# Altium schematic sheet TopLevelSchem.SchDoc
size Letter; DrawnBy: Adam Gilbert; Organization: Altium Limited; Address1: L3, 12a Rodborough Rd; Address2: Frenchs Forest; Address3: NSW; Address4: Australia 2086; DocumentNumber: 1; SheetNumber: 1; SheetTotal: 4
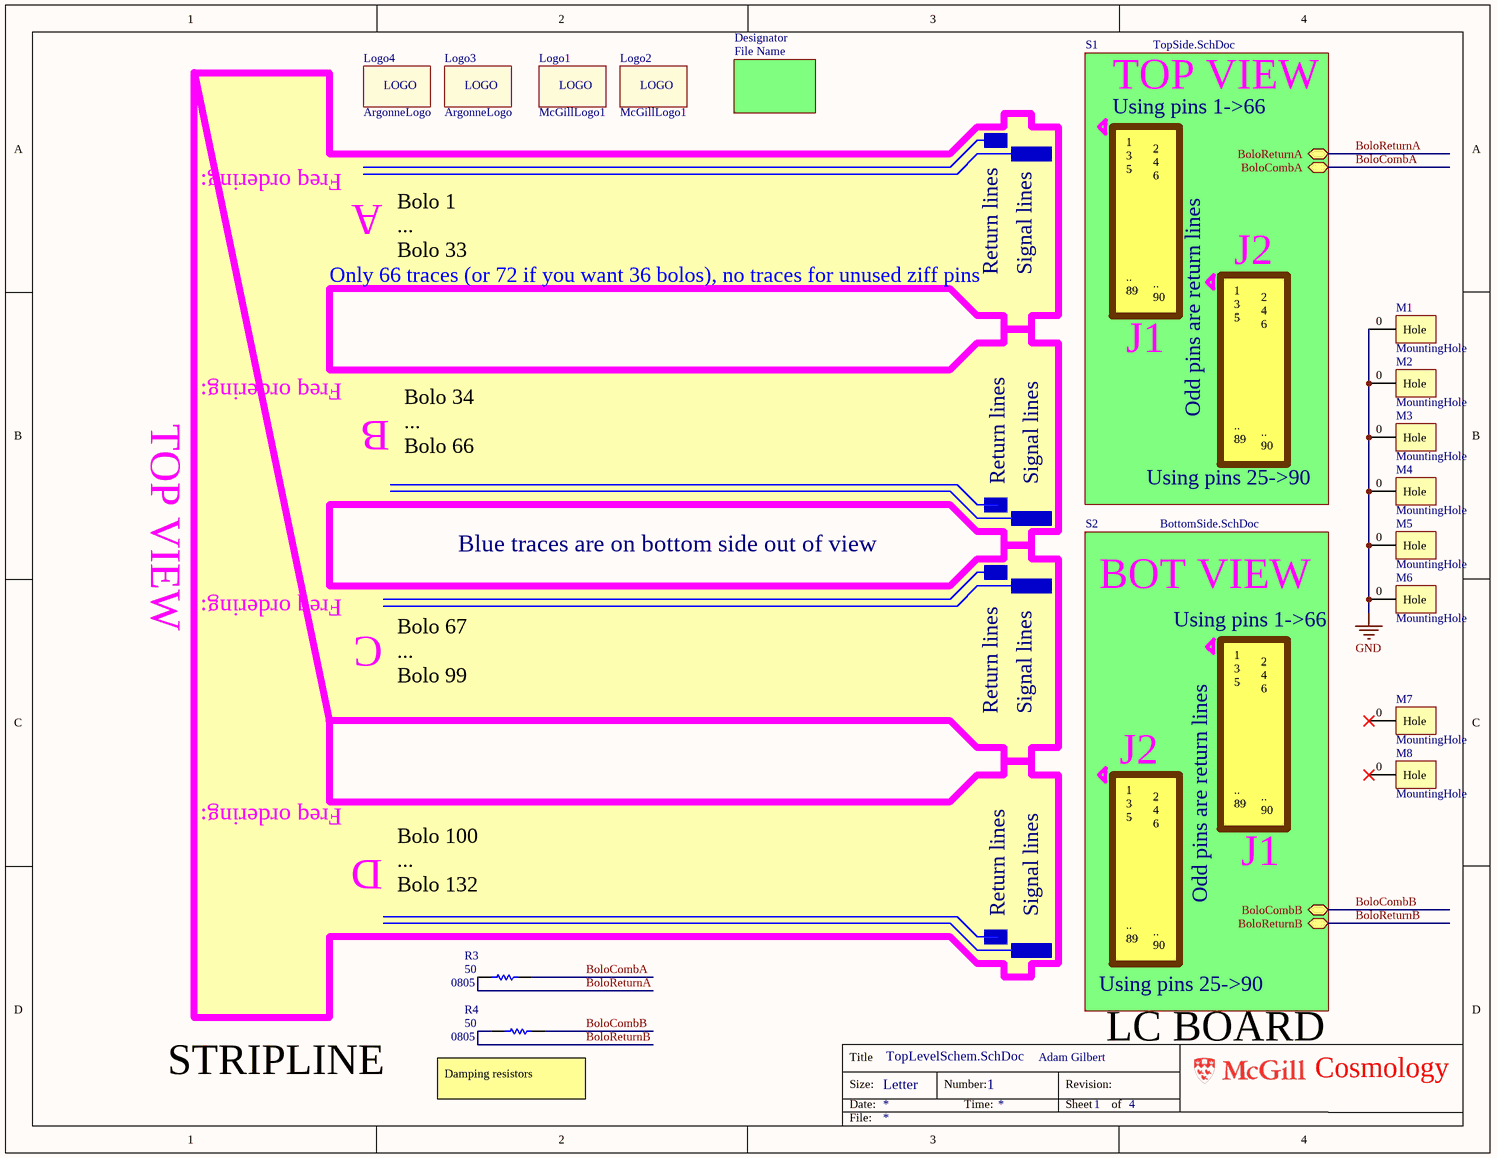
[diagram p0: TopLevelSchem.SchDoc]

## Parts
Logo1  McGillLogo1  [McGillLogo1]  (no BOM)
Logo2  McGillLogo1  [McGillLogo1]  (no BOM)
Logo3  ArgonneLogo  [ArgonneLogo]  (no BOM)
Logo4  ArgonneLogo  [ArgonneLogo]  (no BOM)
M1  MountingHole  [MountingHole]  (no BOM)
M2  MountingHole  [MountingHole]  (no BOM)
M3  MountingHole  [MountingHole]  (no BOM)
M4  MountingHole  [MountingHole]  (no BOM)
M5  MountingHole  [MountingHole]  (no BOM)
M6  MountingHole  [MountingHole]  (no BOM)
M7  MountingHole  [MountingHole]  (no BOM)
M8  MountingHole  [MountingHole]  (no BOM)
R3  50  [0805]
R4  50  [0805]

## Sub-sheets
Designator = File Name: no entries
S1 = TopSide.SchDoc: BoloReturnA, BoloCombA
S2 = BottomSide.SchDoc: BoloCombB, BoloReturnB

## Nets
GND: M1.0(Hole) M2.0(Hole) M3.0(Hole) M4.0(Hole) M5.0(Hole) M6.0(Hole)
BoloCombA: R3.1 ; sheet S1/BoloCombA
BoloCombB: R4.1 ; sheet S2/BoloCombB
BoloReturnA: R3.2 ; sheet S1/BoloReturnA
BoloReturnB: R4.2 ; sheet S2/BoloReturnB

Not connected (* = marked no-connect by the designer): M7 0(Hole)*; M8 0(Hole)*

## Notes on the sheet
- TOP VIEW
- Freq ordering:
- Using pins 1->66
- A
- Only 66 traces (or 72 if you want 36 bolos), no traces for unused ziff pins
- Bolo 1
  ...
  Bolo 33
- Return lines
- Signal lines
- J2
- 1
  3
  5
  ..
  89
- J1
- 2
  4
  6
  ..
  90
- B
- Odd pins are return lines
- Bolo 34
  ...
  Bolo 66
- Using pins 25->90
- Blue traces are on bottom side out of view
- C
- BOT VIEW
- (near M6) Using pins 1->66
- Bolo 67
  ...
  Bolo 99
- D
- Bolo 100
  ...
  Bolo 132
- LC BOARD
- STRIPLINE
- (near R4) Damping resistors
- Title
- Size:
- Date:
- Letter
- Number:
- Time:
- Revision:
- Sheet
- of
- Cosmology
- File:
- (in symbol Logo) LOGO

## Library data of the parts
Logo1-Logo4 = Logo
R3 R4 = Res1206: Resistor; Param1: 100ppm/C; Param: 1%; TechInfo: *; Value: 50